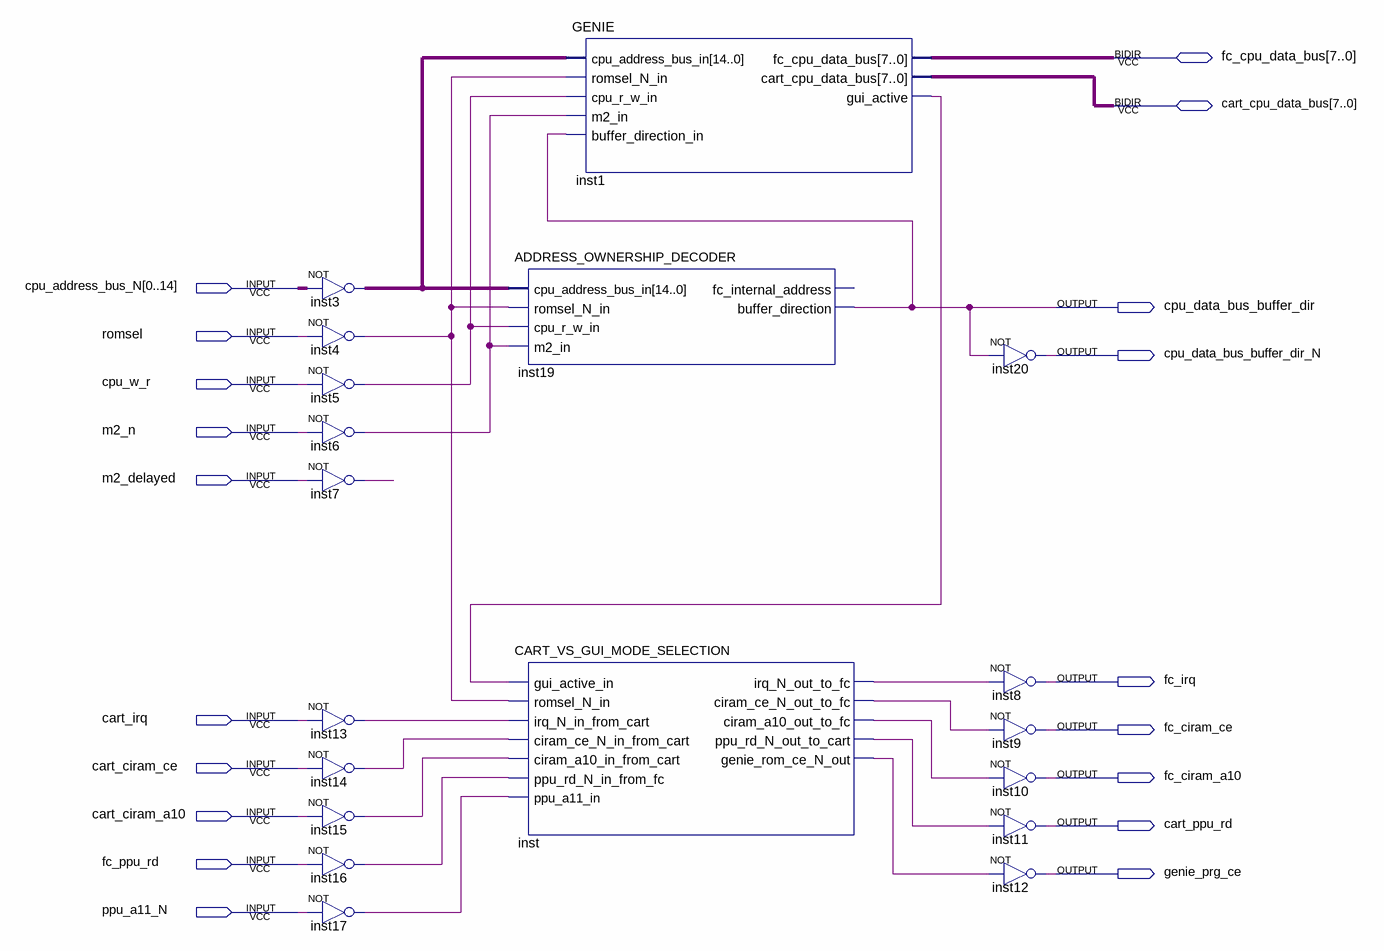
[diagram p0: schematic sheet]
// Quartus schematic game-genie-plus.bdf as structural Verilog: 19 symbols, 19 pins
module \game-genie-plus  (
  input  [0:14] cpu_address_bus_N,
  input  romsel,
  input  cpu_w_r,
  input  m2_n,
  input  m2_delayed,
  input  cart_irq,
  input  cart_ciram_ce,
  input  cart_ciram_a10,
  input  fc_ppu_rd,
  input  ppu_a11_N,
  inout  [7:0] fc_cpu_data_bus,
  inout  [7:0] cart_cpu_data_bus,
  output cpu_data_bus_buffer_dir,
  output cpu_data_bus_buffer_dir_N,
  output fc_irq,
  output fc_ciram_ce,
  output fc_ciram_a10,
  output cart_ppu_rd,
  output genie_prg_ce
);

  wire inst1_gui_active, inst4_out, inst5_out, inst6_out, inst7_out, inst13_out, inst14_out, inst15_out,
       inst16_out, inst17_out, inst_ciram_a10_out_to_fc, inst_ciram_ce_n_out_to_fc, inst_genie_rom_ce_n_out,
       inst_irq_n_out_to_fc, inst_ppu_rd_n_out_to_cart;
  wire [14:0] inst3_out;

  assign inst3_out = ~cpu_address_bus_N;  // NOT inst3, 15 bits wide
  not inst4 (inst4_out, romsel);
  not inst5 (inst5_out, cpu_w_r);
  not inst6 (inst6_out, m2_n);
  not inst7 (inst7_out, m2_delayed);
  not inst13 (inst13_out, cart_irq);
  not inst14 (inst14_out, cart_ciram_ce);
  not inst15 (inst15_out, cart_ciram_a10);
  not inst16 (inst16_out, fc_ppu_rd);
  not inst17 (inst17_out, ppu_a11_N);
  ADDRESS_OWNERSHIP_DECODER inst19 (
    .cpu_address_bus_in(inst3_out), .romsel_N_in(inst4_out), .cpu_r_w_in(inst5_out), .m2_in(inst6_out),
    .buffer_direction(cpu_data_bus_buffer_dir));  // open: fc_internal_address
  CART_VS_GUI_MODE_SELECTION inst (
    .gui_active_in(inst1_gui_active), .romsel_N_in(inst4_out), .irq_N_in_from_cart(inst13_out),
    .ciram_ce_N_in_from_cart(inst14_out), .ciram_a10_in_from_cart(inst15_out),
    .ppu_rd_N_in_from_fc(inst16_out), .ppu_a11_in(inst17_out), .irq_N_out_to_fc(inst_irq_n_out_to_fc),
    .ciram_ce_N_out_to_fc(inst_ciram_ce_n_out_to_fc), .ciram_a10_out_to_fc(inst_ciram_a10_out_to_fc),
    .ppu_rd_N_out_to_cart(inst_ppu_rd_n_out_to_cart), .genie_rom_ce_N_out(inst_genie_rom_ce_n_out));
  GENIE inst1 (
    .cpu_address_bus_in(inst3_out), .romsel_N_in(inst4_out), .cpu_r_w_in(inst5_out), .m2_in(inst6_out),
    .buffer_direction_in(cpu_data_bus_buffer_dir), .gui_active(inst1_gui_active),
    .fc_cpu_data_bus(fc_cpu_data_bus), .cart_cpu_data_bus(cart_cpu_data_bus));
  not inst20 (cpu_data_bus_buffer_dir_N, cpu_data_bus_buffer_dir);
  not inst8 (fc_irq, inst_irq_n_out_to_fc);
  not inst9 (fc_ciram_ce, inst_ciram_ce_n_out_to_fc);
  not inst10 (fc_ciram_a10, inst_ciram_a10_out_to_fc);
  not inst11 (cart_ppu_rd, inst_ppu_rd_n_out_to_cart);
  not inst12 (genie_prg_ce, inst_genie_rom_ce_n_out);
endmodule
